# EAGLE schematic TinyCube10_BetterLib (EAGLE 7.5.0)
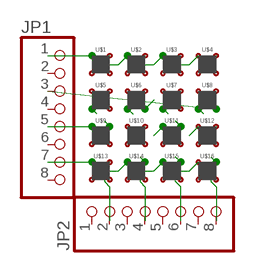
[diagram p0: schematic, sheet 1]

## Parts
JP1  PINHD-1X8BIG  [1X08-BIG]
JP2  PINHD-1X8BIG  [1X08-BIG]
U$1  PILLAR  [10MIL]
U$2  PILLAR  [10MIL]
U$3  PILLAR  [10MIL]
U$4  PILLAR  [10MIL]
U$5  PILLAR  [10MIL]
U$6  PILLAR  [10MIL]
U$7  PILLAR  [10MIL]
U$8  PILLAR  [10MIL]
U$9  PILLAR  [10MIL]
U$10  PILLAR  [10MIL]
U$11  PILLAR  [10MIL]
U$12  PILLAR  [10MIL]
U$13  PILLAR  [10MIL]
U$14  PILLAR  [10MIL]
U$15  PILLAR  [10MIL]
U$16  PILLAR  [10MIL]

## Nets
N$1: JP1.1 U$1.B U$2.B U$3.B U$4.B
N$2: U$6.R
N$3: U$11.B
N$4: JP1.7 U$13.B U$14.B U$15.B U$16.B
N$5: U$13.G
N$6: U$14.G
N$7: U$15.G
N$8: U$16.G
N$9: JP1.3 U$8.R
N$10: U$7.R
N$11: JP1.5 U$9.B
N$12: U$10.B
N$13: U$12.B
N$14: U$3.G
N$15: U$2.G
N$16: U$8.A
N$17: U$4.G
N$18: U$12.G
N$19: U$11.G
N$20: U$10.G
N$21: U$9.G
N$22: U$1.G
N$23: U$5.A
N$24: U$6.A
N$25: U$7.A
Unconnected: JP1.2 JP1.4 JP1.6 JP1.8 JP2.1 JP2.2 JP2.3 JP2.4 JP2.5 JP2.6 JP2.7 JP2.8 U$1.A U$1.R U$2.A U$2.R U$3.A U$3.R U$4.A U$4.R U$5.B U$5.G U$5.R U$6.B U$6.G U$7.B U$7.G U$8.B U$8.G U$9.A U$9.R U$10.A U$10.R U$11.A U$11.R U$12.A U$12.R U$13.A U$13.R U$14.A U$14.R U$15.A U$15.R U$16.A U$16.R

## Library data of the parts
JP1 JP2 = adafruit:PINHD-1X8: PIN HEADER
U$1-U$16 = PILLAR:PILLAR